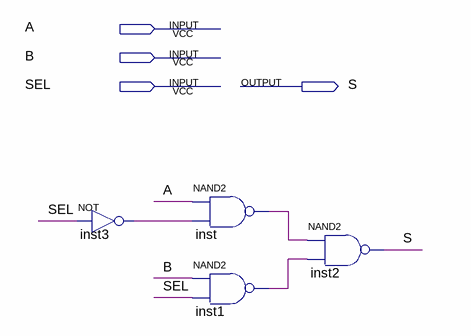
[diagram p0: schematic sheet]
// Quartus schematic MUX2_1BIT.bdf as structural Verilog: 4 symbols, 4 pins
module MUX2_1BIT (
  input  A,
  input  B,
  input  SEL,
  output S
);

  wire inst1_out, inst3_out, inst_out;

  not inst3 (inst3_out, SEL);
  nand inst (inst_out, A, inst3_out);
  nand inst1 (inst1_out, B, SEL);
  nand inst2 (S, inst_out, inst1_out);
endmodule
